# Altium schematic sheet ADAS_ECU_revB.SchDoc
size E; SheetNumber: 1; SheetTotal: 19
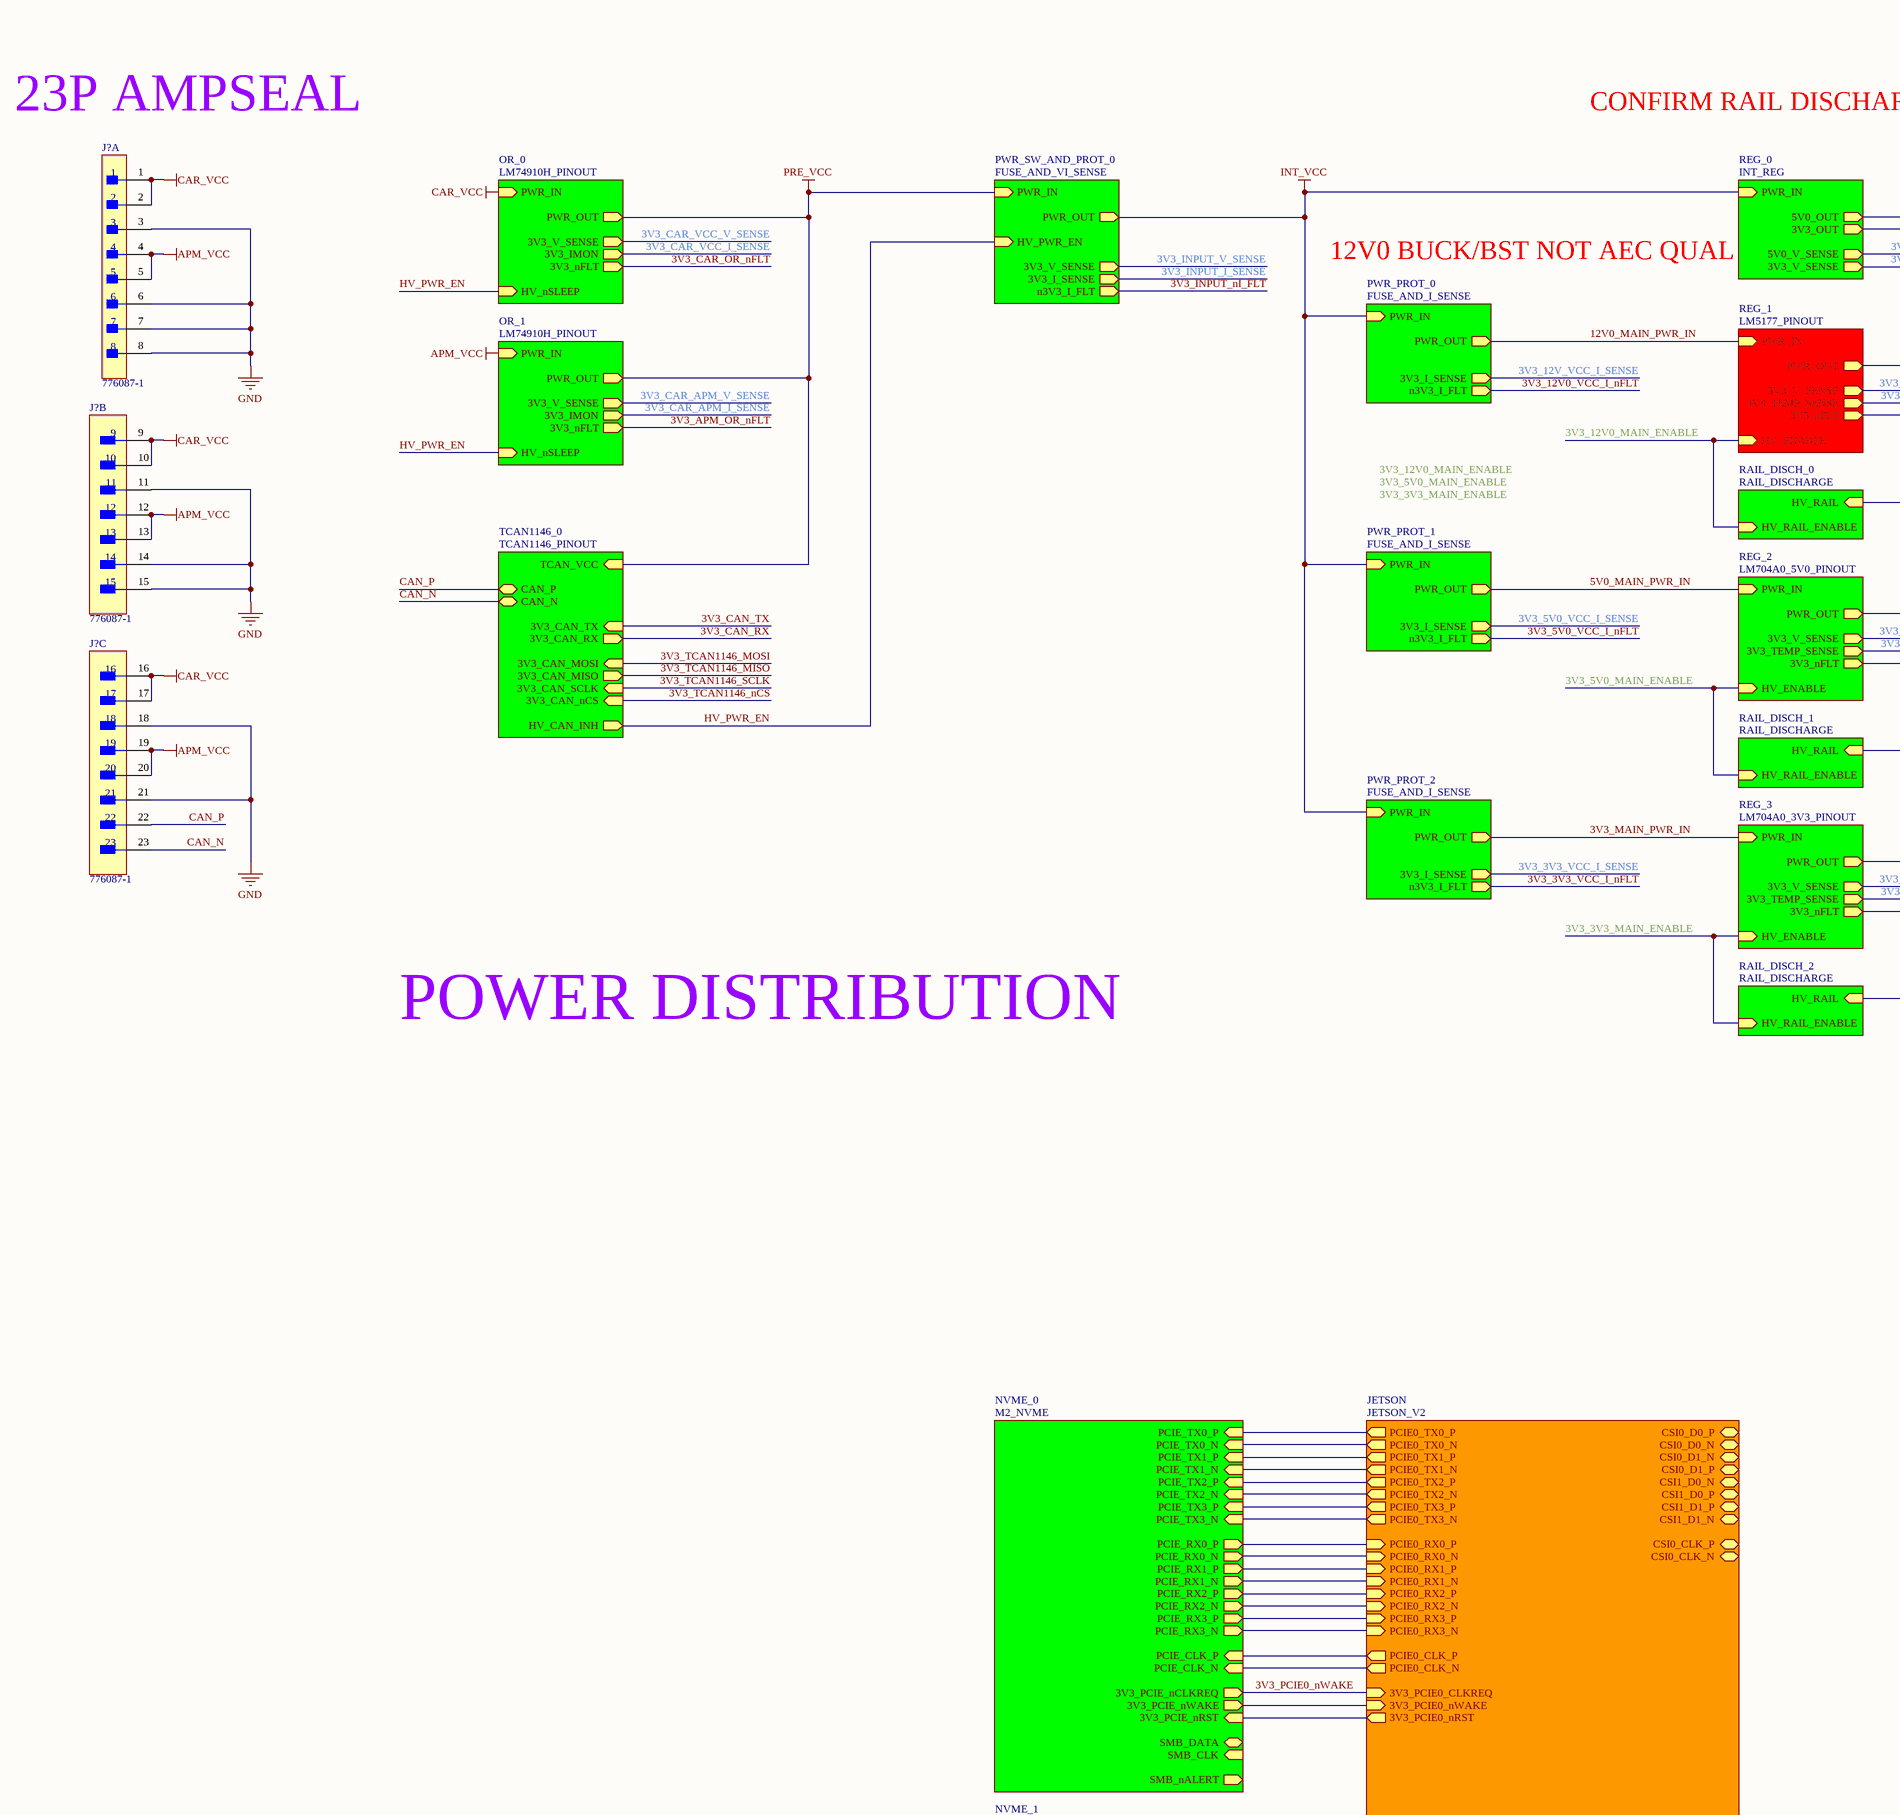
[diagram p0: ADAS_ECU_revB.SchDoc, top left]
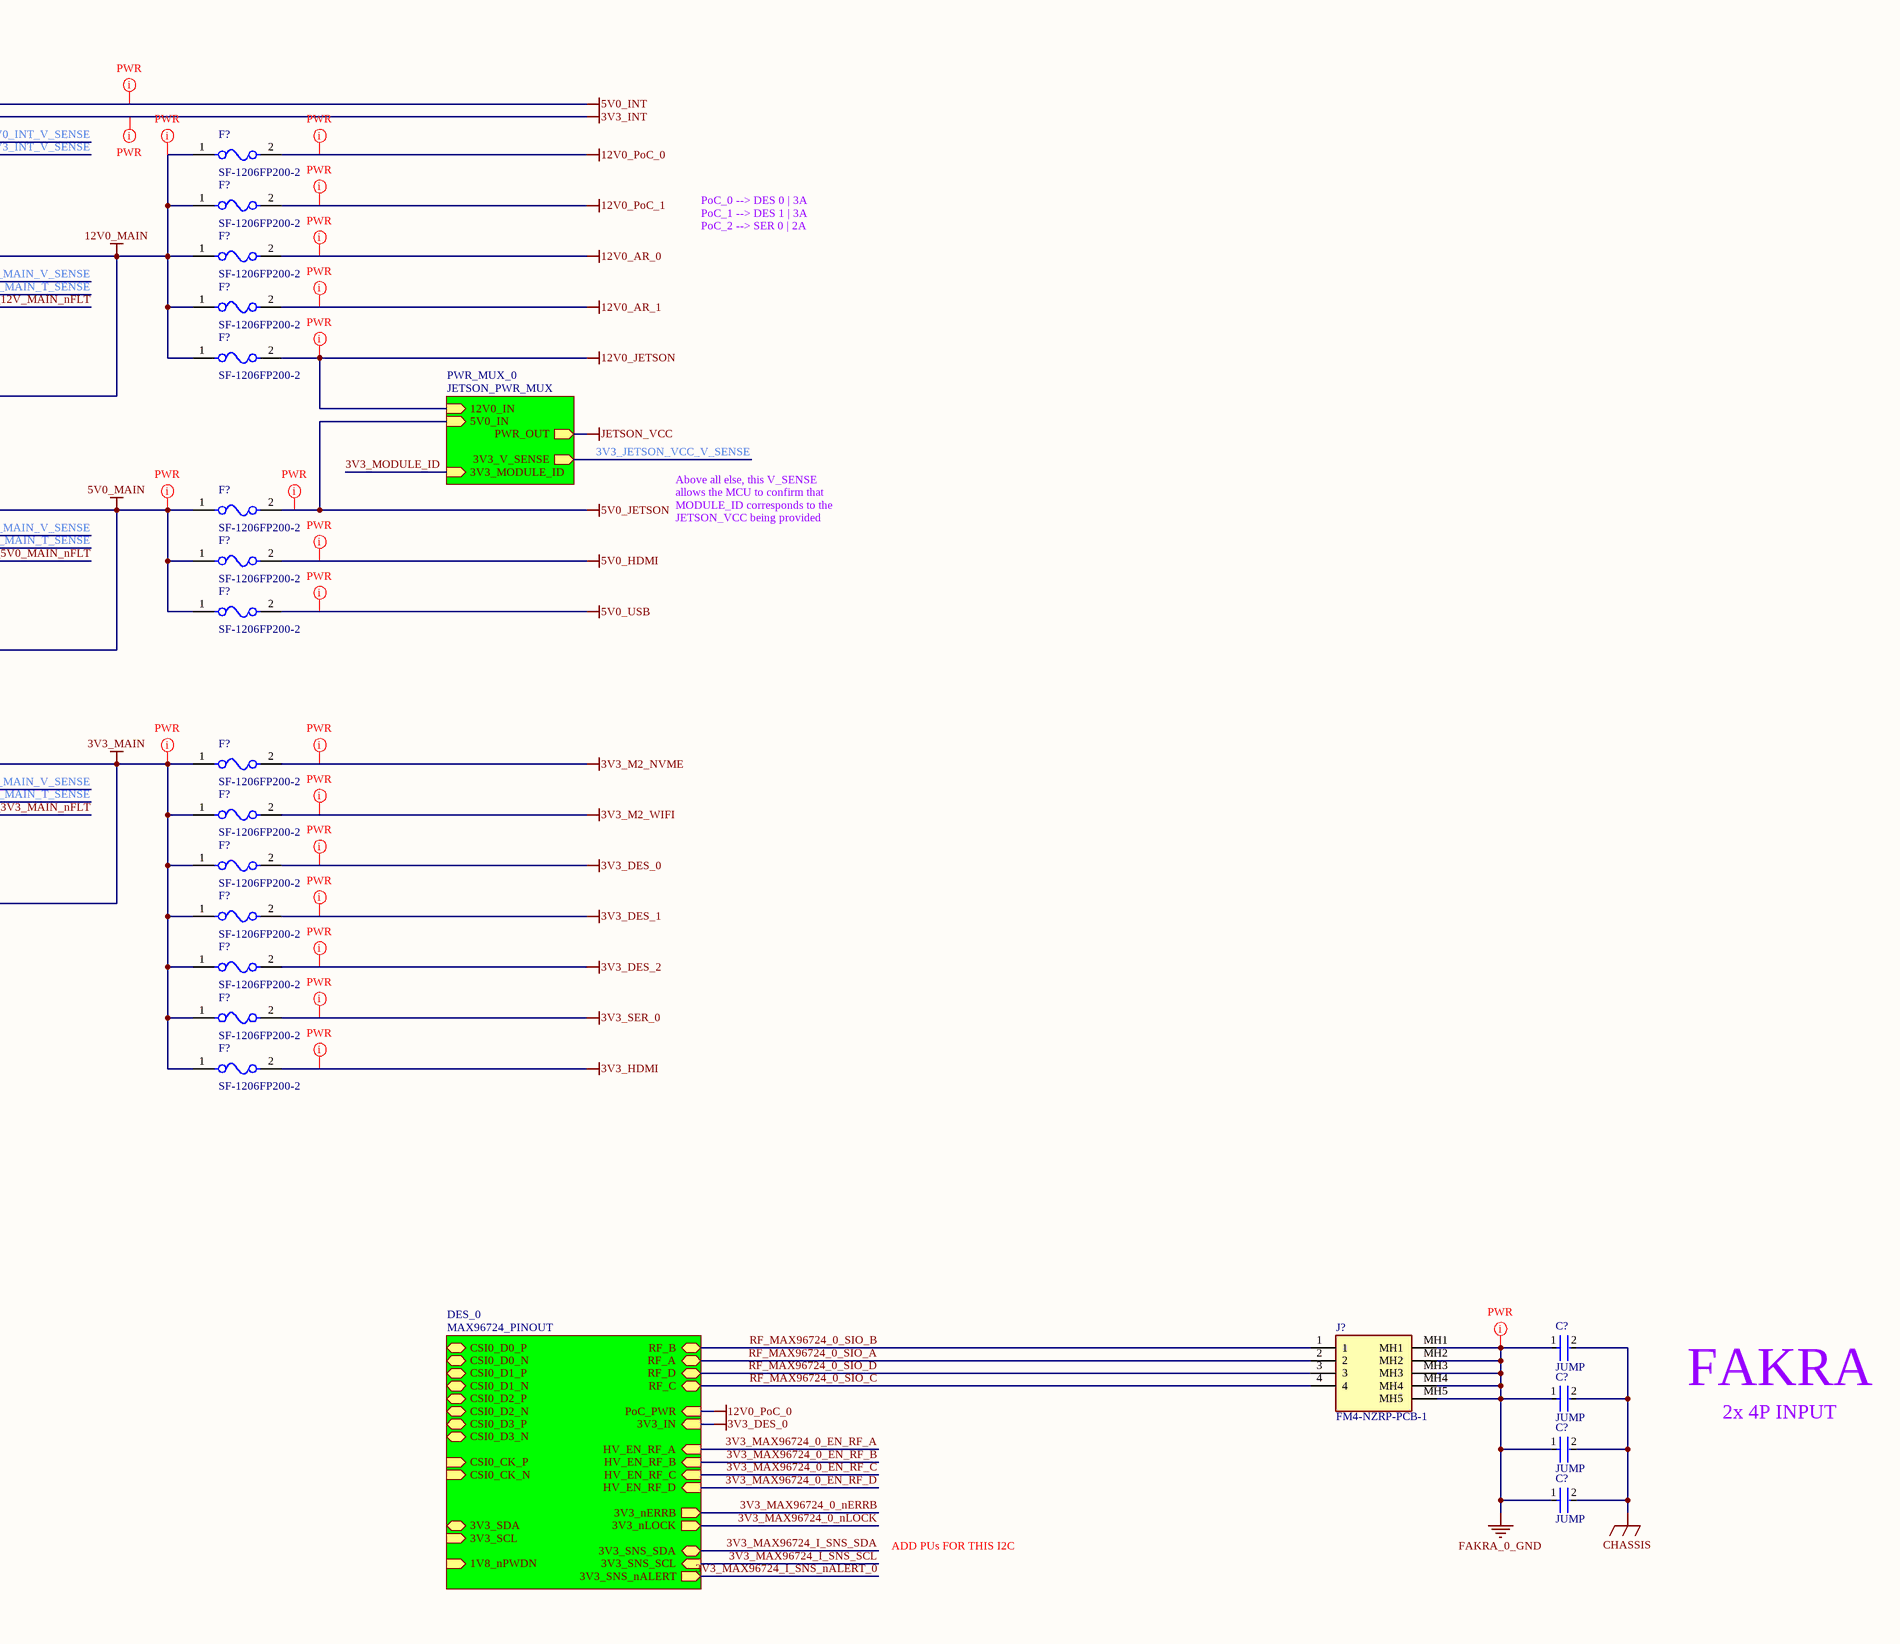
[diagram p1: ADAS_ECU_revB.SchDoc, top right]
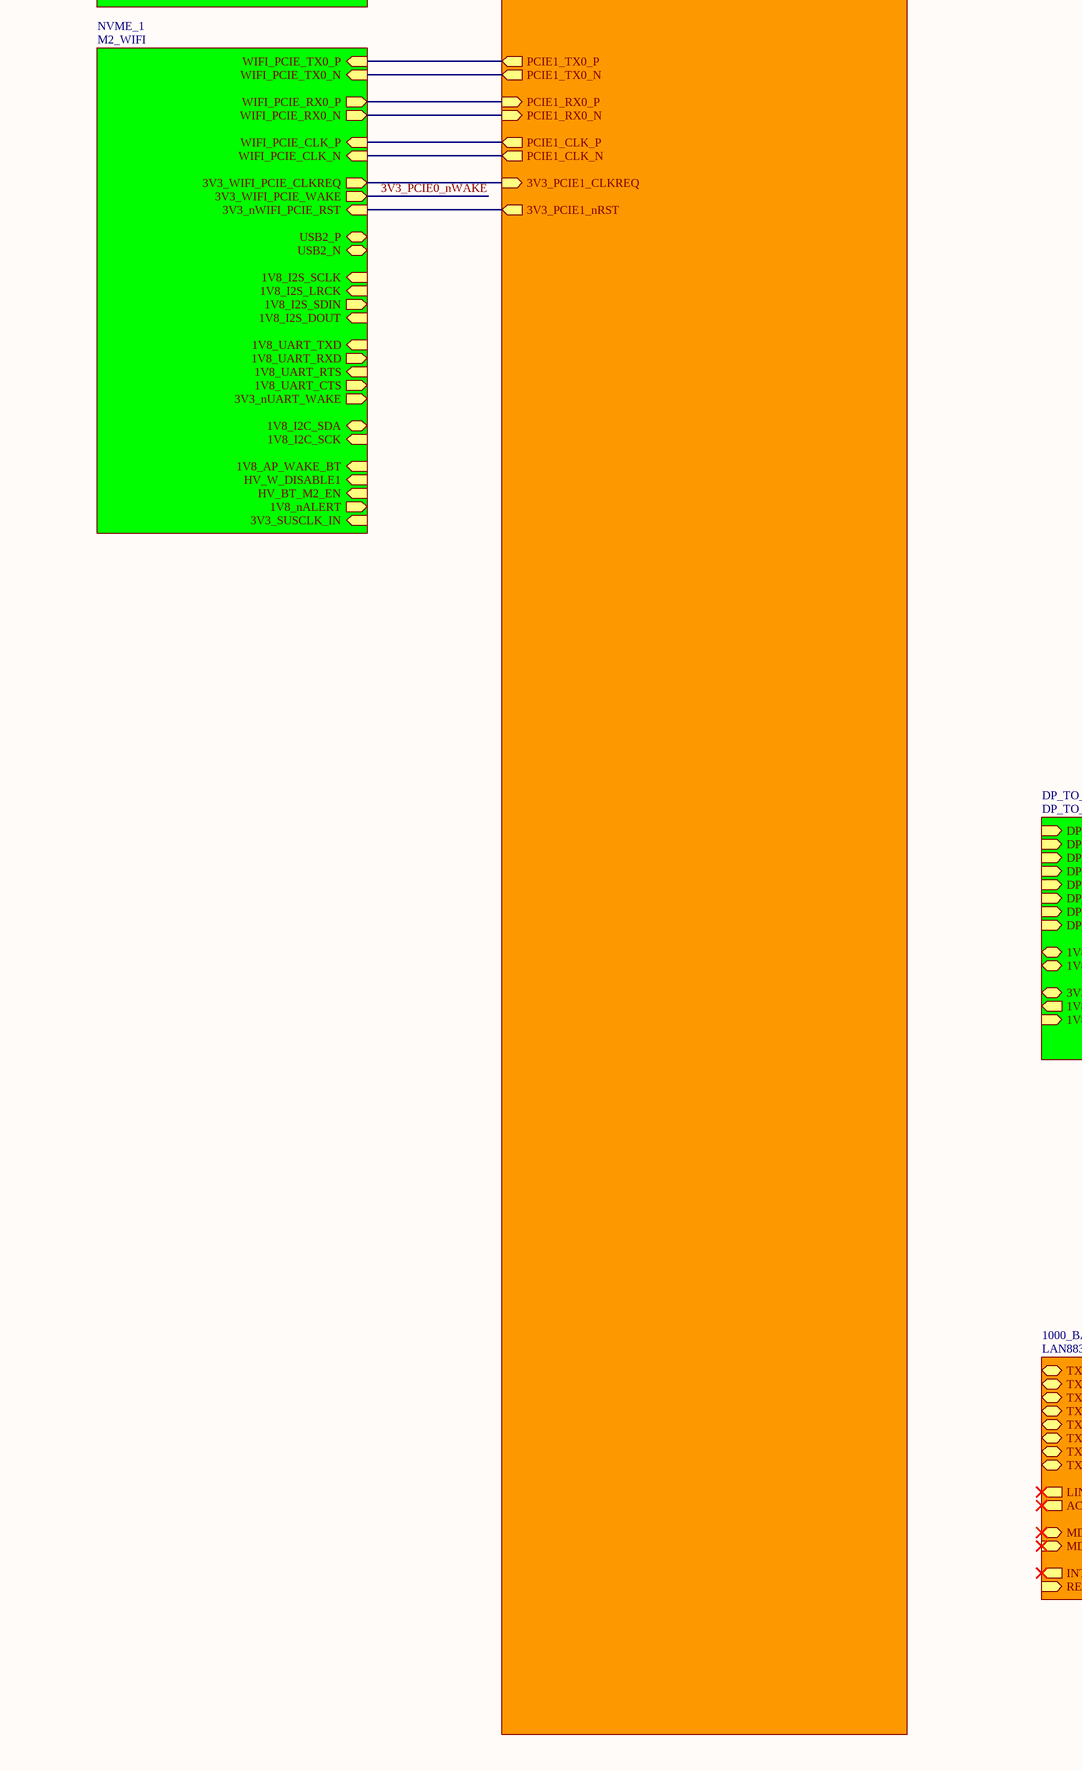
[diagram p2: ADAS_ECU_revB.SchDoc, bottom left]
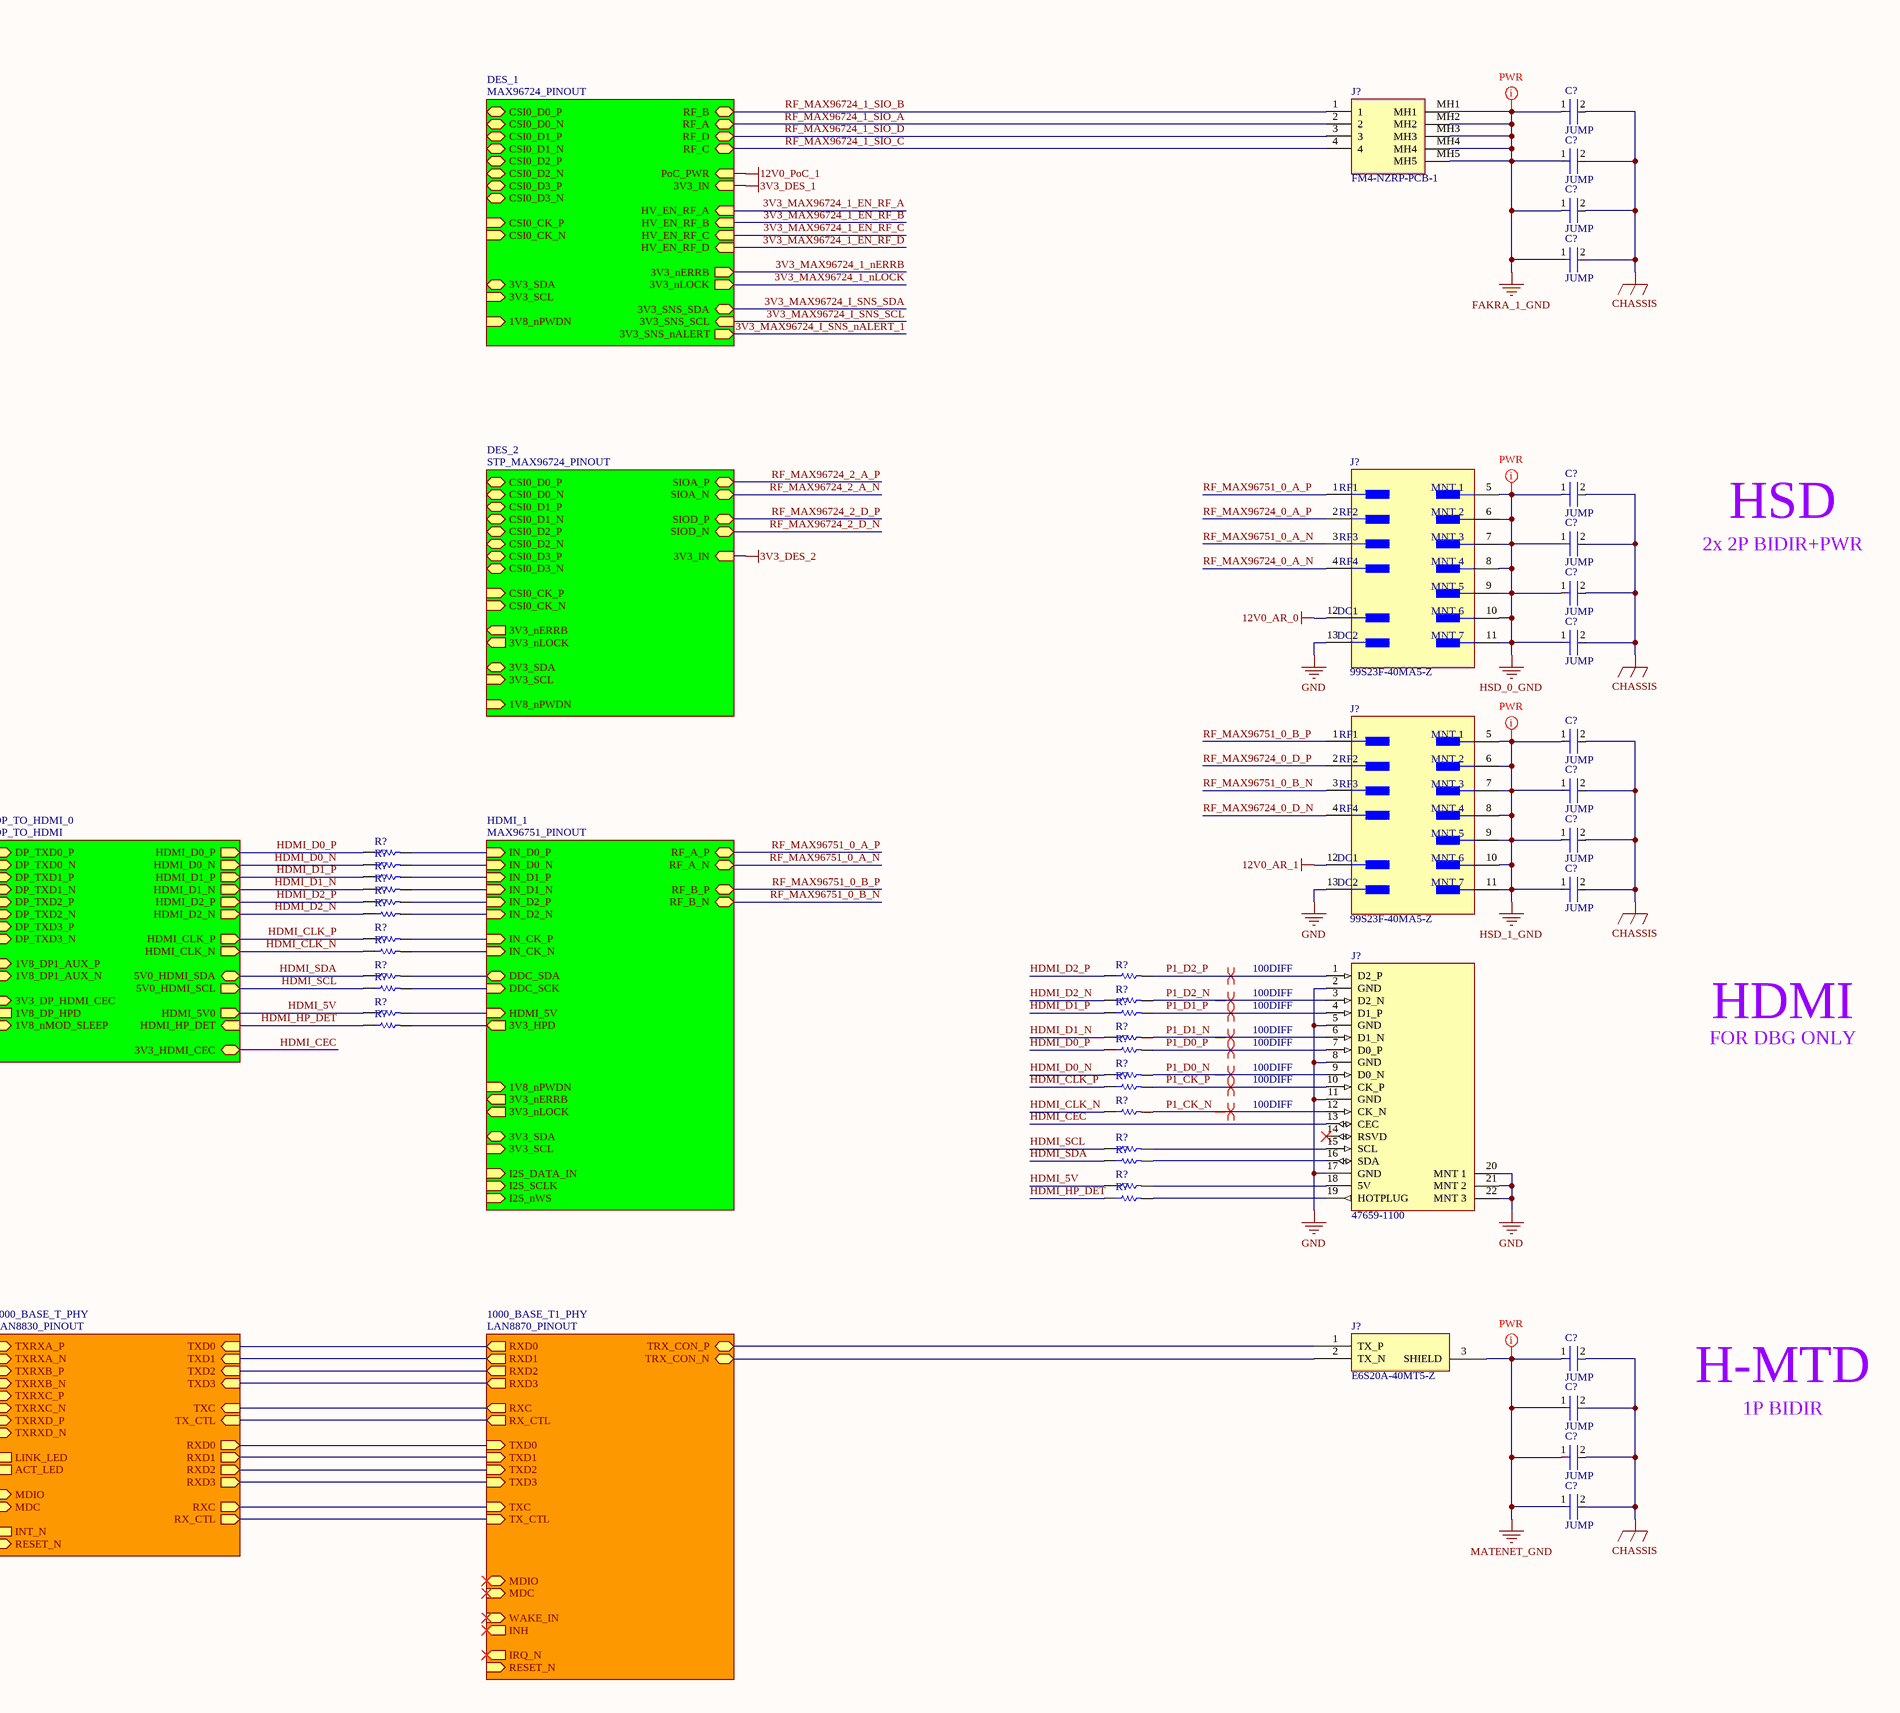
[diagram p3: ADAS_ECU_revB.SchDoc, bottom right]

## Parts
(Parts that share a designator on the sheet are numbered #1, #2 ... from top to bottom, then left to right.)
C?#1  JUMP  [FP-0402-L_1_0_0_05-W_0_5-IPC_A]
C?#2  JUMP  [FP-0402-L_1_0_0_05-W_0_5-IPC_A]
C?#3  JUMP  [FP-0402-L_1_0_0_05-W_0_5-IPC_A]
C?#4  JUMP  [FP-0402-L_1_0_0_05-W_0_5-IPC_A]
C?#5  JUMP  [FP-0402-L_1_0_0_05-W_0_5-IPC_A]
C?#6  JUMP  [FP-0402-L_1_0_0_05-W_0_5-IPC_A]
C?#7  JUMP  [FP-0402-L_1_0_0_05-W_0_5-IPC_A]
C?#8  JUMP  [FP-0402-L_1_0_0_05-W_0_5-IPC_A]
C?#9  JUMP  [FP-0402-L_1_0_0_05-W_0_5-IPC_A]
C?#10  JUMP  [FP-0402-L_1_0_0_05-W_0_5-IPC_A]
C?#11  JUMP  [FP-0402-L_1_0_0_05-W_0_5-IPC_A]
C?#12  JUMP  [FP-0402-L_1_0_0_05-W_0_5-IPC_A]
C?#13  JUMP  [FP-0402-L_1_0_0_05-W_0_5-IPC_A]
C?#14  JUMP  [FP-0402-L_1_0_0_05-W_0_5-IPC_A]
C?#15  JUMP  [FP-0402-L_1_0_0_05-W_0_5-IPC_A]
C?#16  JUMP  [FP-0402-L_1_0_0_05-W_0_5-IPC_A]
C?#17  JUMP  [FP-0402-L_1_0_0_05-W_0_5-IPC_A]
C?#18  JUMP  [FP-0402-L_1_0_0_05-W_0_5-IPC_A]
C?#19  JUMP  [FP-0402-L_1_0_0_05-W_0_5-IPC_A]
C?#20  JUMP  [FP-0402-L_1_0_0_05-W_0_5-IPC_A]
F?#1  SF-1206FP200-2  [FP-SF-1206FP-MFG]
F?#2  SF-1206FP200-2  [FP-SF-1206FP-MFG]
F?#3  SF-1206FP200-2  [FP-SF-1206FP-MFG]
F?#4  SF-1206FP200-2  [FP-SF-1206FP-MFG]
F?#5  SF-1206FP200-2  [FP-SF-1206FP-MFG]
F?#6  SF-1206FP200-2  [FP-SF-1206FP-MFG]
F?#7  SF-1206FP200-2  [FP-SF-1206FP-MFG]
F?#8  SF-1206FP200-2  [FP-SF-1206FP-MFG]
F?#9  SF-1206FP200-2  [FP-SF-1206FP-MFG]
F?#10  SF-1206FP200-2  [FP-SF-1206FP-MFG]
F?#11  SF-1206FP200-2  [FP-SF-1206FP-MFG]
F?#12  SF-1206FP200-2  [FP-SF-1206FP-MFG]
F?#13  SF-1206FP200-2  [FP-SF-1206FP-MFG]
F?#14  SF-1206FP200-2  [FP-SF-1206FP-MFG]
F?#15  SF-1206FP200-2  [FP-SF-1206FP-MFG]
J?#1  776087-1  [FP-776087-1-MFG]  (part A of 3)
J?#2  776087-1  [FP-776087-1-MFG]  (part B of 3)
J?#3  776087-1  [FP-776087-1-MFG]  (part C of 3)
J?#4  FM4-NZRP-PCB-1  [FM4-NZRP-PCB-1-Footprint-1]
J?#5  FM4-NZRP-PCB-1  [FM4-NZRP-PCB-1-Footprint-1]
J?#6  99S23F-40MA5-Z  [FP-99S23F-40MA5-Z-MFG]
J?#7  99S23F-40MA5-Z  [FP-99S23F-40MA5-Z-MFG]
J?#8  47659-1100  [FP-47659-1100-MFG]
J?#9  E6S20A-40MT5-Z  [E6S20A-40MT5-Z-Footprint-1]
R?#1  0402 JUMPER  [RESC1005X40X25ML05T05]  (value not drawn)
R?#2  0402 JUMPER  [RESC1005X40X25ML05T05]  (value not drawn)
R?#3  0402 JUMPER  [RESC1005X40X25ML05T05]  (value not drawn)
R?#4  0402 JUMPER  [RESC1005X40X25ML05T05]  (value not drawn)
R?#5  0402 JUMPER  [RESC1005X40X25ML05T05]  (value not drawn)
R?#6  0402 JUMPER  [RESC1005X40X25ML05T05]  (value not drawn)
R?#7  0402 JUMPER  [RESC1005X40X25ML05T05]  (value not drawn)
R?#8  0402 JUMPER  [RESC1005X40X25ML05T05]  (value not drawn)
R?#9  0402 JUMPER  [RESC1005X40X25ML05T05]  (value not drawn)
R?#10  0402 JUMPER  [RESC1005X40X25ML05T05]  (value not drawn)
R?#11  0402 JUMPER  [RESC1005X40X25ML05T05]  (value not drawn)
R?#12  0402 JUMPER  [RESC1005X40X25ML05T05]  (value not drawn)
R?#13  0402 JUMPER  [RESC1005X40X25ML05T05]  (value not drawn)
R?#14  0402 JUMPER  [RESC1005X40X25ML05T05]  (value not drawn)
R?#15  0402 JUMPER  [RESC1005X40X25ML05T05]  (value not drawn)
R?#16  0402 JUMPER  [RESC1005X40X25ML05T05]  (value not drawn)
R?#17  0402 JUMPER  [RESC1005X40X25ML05T05]  (value not drawn)
R?#18  0402 JUMPER  [RESC1005X40X25ML05T05]  (value not drawn)
R?#19  0402 JUMPER  [RESC1005X40X25ML05T05]  (value not drawn)
R?#20  0402 JUMPER  [RESC1005X40X25ML05T05]  (value not drawn)
R?#21  0402 JUMPER  [RESC1005X40X25ML05T05]  (value not drawn)
R?#22  0402 JUMPER  [RESC1005X40X25ML05T05]  (value not drawn)
R?#23  0402 JUMPER  [RESC1005X40X25ML05T05]  (value not drawn)
R?#24  0402 JUMPER  [RESC1005X40X25ML05T05]  (value not drawn)

## Sub-sheets
1000_BASE_T1_PHY = LAN8870_PINOUT: RXD0 (out), RXD1 (out), RXD2 (out), RXD3 (out), RXC (out), RX_CTL (out), TXD0 (in), TXD1 (in), TXD2 (in), TXD3 (in), TXC (in), TX_CTL (in), TRX_CON_P (bidir), TRX_CON_N (bidir), MDIO (bidir), MDC (in), IRQ_N (out), RESET_N (in), WAKE_IN (in), INH (out)
1000_BASE_T_PHY = LAN8830_PINOUT: TXD0 (in), TXD1 (in), TXD2 (in), TXD3 (in), TXC (in), TX_CTL (in), RXD0 (out), RXD1 (out), RXD2 (out), RXD3 (out), RXC (out), RX_CTL (out), TXRXA_P (bidir), TXRXA_N (bidir), ACT_LED (out), LINK_LED (out), MDIO (bidir), MDC (in), INT_N (out), RESET_N (in), TXRXB_P (bidir), TXRXB_N (bidir), TXRXC_P (bidir), TXRXC_N (bidir), TXRXD_P (bidir), TXRXD_N (bidir)
DES_0 = MAX96724_PINOUT: CSI0_D0_P (bidir), CSI0_D0_N (bidir), CSI0_D1_P (bidir), CSI0_D1_N (bidir), CSI0_D2_P (bidir), CSI0_D2_N (bidir), CSI0_D3_P (bidir), CSI0_D3_N (bidir), CSI0_CK_P (in), CSI0_CK_N (in), PoC_PWR (in), RF_B (bidir), RF_A (bidir), RF_C (bidir), RF_D (bidir), 3V3_IN (in), 3V3_SDA (bidir), 3V3_SCL (in), 1V8_nPWDN (in), 3V3_SNS_SDA (bidir), 3V3_SNS_SCL (in), 3V3_nERRB (out), 3V3_nLOCK (out), 3V3_SNS_nALERT (out), HV_EN_RF_A (in), HV_EN_RF_B (in), HV_EN_RF_C (in), HV_EN_RF_D (in)
DES_1 = MAX96724_PINOUT: CSI0_D0_P (bidir), CSI0_D0_N (bidir), CSI0_D1_P (bidir), CSI0_D1_N (bidir), CSI0_D2_P (bidir), CSI0_D2_N (bidir), CSI0_D3_P (bidir), CSI0_D3_N (bidir), CSI0_CK_P (in), CSI0_CK_N (in), PoC_PWR (in), RF_B (bidir), RF_A (bidir), RF_C (bidir), RF_D (bidir), 3V3_IN (in), 3V3_SDA (bidir), 3V3_SCL (in), 1V8_nPWDN (in), 3V3_SNS_SDA (bidir), 3V3_SNS_SCL (in), 3V3_nERRB (out), 3V3_nLOCK (out), HV_EN_RF_A (in), HV_EN_RF_B (in), HV_EN_RF_C (in), HV_EN_RF_D (in), 3V3_SNS_nALERT (out)
DES_2 = STP_MAX96724_PINOUT: CSI0_D0_P (bidir), CSI0_D0_N (bidir), CSI0_D1_P (bidir), CSI0_D1_N (bidir), CSI0_D2_P (bidir), CSI0_D2_N (bidir), CSI0_D3_P (bidir), CSI0_D3_N (bidir), CSI0_CK_P (in), CSI0_CK_N (in), 3V3_IN (in), 3V3_SDA (bidir), 3V3_SCL (in), 1V8_nPWDN (in), 3V3_nERRB (out), 3V3_nLOCK (out), SIOA_P (bidir), SIOA_N (bidir), SIOD_P (bidir), SIOD_N (bidir)
DP_TO_HDMI_0 = DP_TO_HDMI: 1V8_DP_HPD (out), HDMI_D2_P (out), HDMI_D2_N (out), HDMI_D1_P (out), HDMI_D1_N (out), HDMI_D0_P (out), HDMI_D0_N (out), HDMI_CLK_P (out), HDMI_CLK_N (out), HDMI_HP_DET (in), DP_TXD0_P (in), DP_TXD0_N (in), DP_TXD1_P (in), DP_TXD1_N (in), DP_TXD2_P (in), DP_TXD2_N (in), DP_TXD3_P (in), DP_TXD3_N (in), 1V8_DP1_AUX_N (bidir), 1V8_DP1_AUX_P (bidir), 3V3_HDMI_CEC (bidir), 1V8_nMOD_SLEEP (in), 3V3_DP_HDMI_CEC (bidir), 5V0_HDMI_SDA (bidir), 5V0_HDMI_SCL (out), HDMI_5V0 (out)
HDMI_1 = MAX96751_PINOUT: IN_D0_P (in), IN_D0_N (in), IN_D1_P (in), IN_D1_N (in), IN_D2_P (in), IN_D2_N (in), IN_CK_N (in), IN_CK_P (in), DDC_SCK (in), DDC_SDA (bidir), 3V3_HPD (out), RF_A_P (bidir), RF_A_N (bidir), RF_B_P (bidir), RF_B_N (bidir), HDMI_5V (in), 3V3_SDA (bidir), 3V3_SCL (in), I2S_DATA_IN (in), I2S_SCLK (in), I2S_nWS (in), 3V3_nERRB (out), 3V3_nLOCK (out), 1V8_nPWDN (in)
JETSON = JETSON_V2: PCIE0_TX0_N (out), PCIE0_TX0_P (out), PCIE0_TX1_N (out), PCIE0_TX1_P (out), PCIE0_TX2_N (out), PCIE0_TX2_P (out), PCIE0_TX3_N (out), PCIE0_TX3_P (out), PCIE0_RX0_N (in), PCIE0_RX0_P (in), PCIE0_RX1_N (in), PCIE0_RX1_P (in), PCIE0_RX2_N (in), PCIE0_RX2_P (in), PCIE0_RX3_N (in), PCIE0_RX3_P (in), PCIE0_CLK_N (out), PCIE0_CLK_P (out), 3V3_PCIE0_CLKREQ (in), 3V3_PCIE0_nWAKE (in), 3V3_PCIE0_nRST (out), PCIE1_TX0_N (out), PCIE1_TX0_P (out), PCIE1_RX0_N (in), PCIE1_RX0_P (in), PCIE1_CLK_N (out), PCIE1_CLK_P (out), 3V3_PCIE1_nRST (out), 3V3_PCIE1_CLKREQ (in), CSI0_D0_N (bidir), CSI0_D0_P (bidir), CSI0_D1_N (bidir), CSI0_D1_P (bidir), CSI1_D0_N (bidir), CSI1_D0_P (bidir), CSI1_D1_N (bidir), CSI1_D1_P (bidir), CSI0_CLK_N (bidir), CSI0_CLK_P (bidir)
NVME_0 = M2_NVME: SMB_DATA (bidir), SMB_CLK (in), SMB_nALERT (out), PCIE_TX3_N (in), PCIE_TX3_P (in), PCIE_TX2_N (in), PCIE_TX2_P (in), PCIE_TX1_N (in), PCIE_TX1_P (in), PCIE_TX0_N (in), PCIE_TX0_P (in), PCIE_RX3_N (out), PCIE_RX3_P (out), PCIE_RX2_N (out), PCIE_RX2_P (out), PCIE_RX1_N (out), PCIE_RX1_P (out), PCIE_RX0_N (out), PCIE_RX0_P (out), PCIE_CLK_N (in), PCIE_CLK_P (in), 3V3_PCIE_nRST (in), 3V3_PCIE_nCLKREQ (out), 3V3_PCIE_nWAKE (out)
NVME_1 = M2_WIFI: WIFI_PCIE_TX0_P (in), WIFI_PCIE_TX0_N (in), WIFI_PCIE_RX0_P (out), WIFI_PCIE_RX0_N (out), WIFI_PCIE_CLK_P (in), WIFI_PCIE_CLK_N (in), USB2_P (bidir), USB2_N (bidir), 1V8_I2S_SCLK (in), 1V8_I2S_LRCK (in), 1V8_I2S_SDIN (out), 1V8_I2S_DOUT (in), 1V8_UART_RXD (out), 1V8_UART_TXD (in), 1V8_UART_RTS (in), 1V8_UART_CTS (out), 3V3_nUART_WAKE (out), 3V3_WIFI_PCIE_CLKREQ (out), 3V3_WIFI_PCIE_WAKE (out), 3V3_nWIFI_PCIE_RST (in), 1V8_I2C_SCK (in), 1V8_I2C_SDA (bidir), HV_W_DISABLE1 (in), HV_BT_M2_EN (in), 1V8_nALERT (out), 3V3_SUSCLK_IN (in), 1V8_AP_WAKE_BT (in)
OR_0 = LM74910H_PINOUT: PWR_IN (in), PWR_OUT (out), 3V3_nFLT (out), HV_nSLEEP (in), 3V3_IMON (out), 3V3_V_SENSE (out)
OR_1 = LM74910H_PINOUT: PWR_IN (in), PWR_OUT (out), 3V3_nFLT (out), HV_nSLEEP (in), 3V3_IMON (out), 3V3_V_SENSE (out)
PWR_MUX_0 = JETSON_PWR_MUX: 12V0_IN (in), 5V0_IN (in), 3V3_MODULE_ID (in), PWR_OUT (out), 3V3_V_SENSE (out)
PWR_PROT_0 = FUSE_AND_I_SENSE: PWR_IN (in), PWR_OUT (out), 3V3_I_SENSE (out), n3V3_I_FLT (out)
PWR_PROT_1 = FUSE_AND_I_SENSE: PWR_IN (in), PWR_OUT (out), 3V3_I_SENSE (out), n3V3_I_FLT (out)
PWR_PROT_2 = FUSE_AND_I_SENSE: PWR_IN (in), PWR_OUT (out), 3V3_I_SENSE (out), n3V3_I_FLT (out)
PWR_SW_AND_PROT_0 = FUSE_AND_VI_SENSE: PWR_IN (in), PWR_OUT (out), 3V3_I_SENSE (out), n3V3_I_FLT (out), HV_PWR_EN (in), 3V3_V_SENSE (out)
RAIL_DISCH_0 = RAIL_DISCHARGE: HV_RAIL (in), HV_RAIL_ENABLE (in)
RAIL_DISCH_1 = RAIL_DISCHARGE: HV_RAIL_ENABLE (in), HV_RAIL (in)
RAIL_DISCH_2 = RAIL_DISCHARGE: HV_RAIL_ENABLE (in), HV_RAIL (in)
REG_0 = INT_REG: PWR_IN (in), 5V0_OUT (out), 3V3_OUT (out), 5V0_V_SENSE (out), 3V3_V_SENSE (out)
REG_1 = LM5177_PINOUT: PWR_IN (in), PWR_OUT (out), HV_ENABLE (in), 3V3_nFLT (out), 3V3_V_SENSE (out), 3V3_TEMP_SENSE (out)
REG_2 = LM704A0_5V0_PINOUT: PWR_IN (in), PWR_OUT (out), HV_ENABLE (in), 3V3_nFLT (out), 3V3_V_SENSE (out), 3V3_TEMP_SENSE (out)
REG_3 = LM704A0_3V3_PINOUT: PWR_IN (in), PWR_OUT (out), HV_ENABLE (in), 3V3_nFLT (out), 3V3_V_SENSE (out), 3V3_TEMP_SENSE (out)
TCAN1146_0 = TCAN1146_PINOUT: CAN_P (bidir), CAN_N (bidir), HV_CAN_INH (out), TCAN_VCC (in), 3V3_CAN_TX (in), 3V3_CAN_RX (out), 3V3_CAN_MOSI (in), 3V3_CAN_MISO (out), 3V3_CAN_SCLK (in), 3V3_CAN_nCS (in)

## Nets
3V3_DES_0: F?#11.2 ; sheet DES_0/3V3_IN
3V3_DES_1: F?#12.2 ; sheet DES_1/3V3_IN
3V3_DES_2: F?#13.2 ; sheet DES_2/3V3_IN
3V3_HDMI: F?#15.2
3V3_INT: sheet REG_0/3V3_OUT
3V3_M2_NVME: F?#9.2
3V3_M2_WIFI: F?#10.2
3V3_MAIN: F?#9.1 F?#10.1 F?#11.1 F?#12.1 F?#13.1 F?#14.1 F?#15.1 ; sheet RAIL_DISCH_2/HV_RAIL, sheet REG_3/PWR_OUT
3V3_SER_0: F?#14.2
5V0_HDMI: F?#7.2
5V0_INT: sheet REG_0/5V0_OUT
5V0_JETSON: F?#6.2 ; sheet PWR_MUX_0/5V0_IN
5V0_MAIN: F?#6.1 F?#7.1 F?#8.1 ; sheet RAIL_DISCH_1/HV_RAIL, sheet REG_2/PWR_OUT
5V0_USB: F?#8.2
12V0_AR_0: F?#3.2 J?#6.12
12V0_AR_1: F?#4.2 J?#7.12
12V0_JETSON: F?#5.2 ; sheet PWR_MUX_0/12V0_IN
12V0_MAIN: F?#1.1 F?#2.1 F?#3.1 F?#4.1 F?#5.1 ; sheet RAIL_DISCH_0/HV_RAIL, sheet REG_1/PWR_OUT
12V0_PoC_0: F?#1.2 ; sheet DES_0/PoC_PWR
12V0_PoC_1: F?#2.2 ; sheet DES_1/PoC_PWR
APM_VCC: J?#1.4 J?#1.5 J?#2.12 J?#2.13 J?#3.19 J?#3.20 ; sheet OR_1/PWR_IN
CAR_VCC: J?#1.1 J?#1.2 J?#2.9 J?#2.10 J?#3.16 J?#3.17 ; sheet OR_0/PWR_IN
CHASSIS: C?#1.2 C?#2.2 C?#3.2 C?#4.2 C?#5.2 C?#6.2 C?#7.2 C?#8.2 C?#9.2 C?#10.2 C?#11.2 C?#12.2 C?#13.2 C?#14.2 C?#15.2 C?#16.2 C?#17.2 C?#18.2 C?#19.2 C?#20.2
FAKRA_0_GND: C?#1.1 C?#2.1 C?#3.1 C?#4.1 J?#4.MH1 J?#4.MH2 J?#4.MH3 J?#4.MH4 J?#4.MH5
FAKRA_1_GND: C?#5.1 C?#6.1 C?#7.1 C?#8.1 J?#5.MH1 J?#5.MH2 J?#5.MH3 J?#5.MH4 J?#5.MH5
GND: J?#1.3 J?#1.6 J?#1.7 J?#1.8 J?#2.11 J?#2.14 J?#2.15 J?#3.18 J?#3.21 J?#6.13 J?#7.13 J?#8.2(GND) J?#8.5(GND) J?#8.8(GND) J?#8.11(GND) J?#8.17(GND) J?#8.20(MNT_1) J?#8.21(MNT_2) J?#8.22(MNT_3)
HSD_0_GND: C?#9.1 C?#10.1 C?#11.1 C?#12.1 J?#6.5(MNT_1) J?#6.6(MNT_2) J?#6.7(MNT_3) J?#6.8(MNT_4) J?#6.9(MNT_5) J?#6.10(MNT_6) J?#6.11(MNT_7)
HSD_1_GND: C?#13.1 C?#14.1 C?#15.1 C?#16.1 J?#7.5(MNT_1) J?#7.6(MNT_2) J?#7.7(MNT_3) J?#7.8(MNT_4) J?#7.9(MNT_5) J?#7.10(MNT_6) J?#7.11(MNT_7)
INT_VCC: sheet PWR_PROT_0/PWR_IN, sheet REG_0/PWR_IN, sheet PWR_PROT_1/PWR_IN, sheet PWR_PROT_2/PWR_IN, sheet PWR_SW_AND_PROT_0/PWR_OUT
JETSON_VCC: sheet PWR_MUX_0/PWR_OUT
MATENET_GND: C?#17.1 C?#18.1 C?#19.1 C?#20.1 J?#9.3(SHIELD)
PRE_VCC: sheet TCAN1146_0/TCAN_VCC, sheet OR_0/PWR_OUT, sheet OR_1/PWR_OUT, sheet PWR_SW_AND_PROT_0/PWR_IN
3V3_3V3_INT_V_SENSE: sheet REG_0/3V3_V_SENSE
3V3_3V3_MAIN_ENABLE: sheet RAIL_DISCH_2/HV_RAIL_ENABLE, sheet REG_3/HV_ENABLE
3V3_3V3_MAIN_nFLT: sheet REG_3/3V3_nFLT
3V3_3V3_MAIN_T_SENSE: sheet REG_3/3V3_TEMP_SENSE
3V3_3V3_MAIN_V_SENSE: sheet REG_3/3V3_V_SENSE
3V3_3V3_VCC_I_nFLT: sheet PWR_PROT_2/n3V3_I_FLT
3V3_3V3_VCC_I_SENSE: sheet PWR_PROT_2/3V3_I_SENSE
3V3_5V0_INT_V_SENSE: sheet REG_0/5V0_V_SENSE
3V3_5V0_MAIN_ENABLE: sheet RAIL_DISCH_1/HV_RAIL_ENABLE, sheet REG_2/HV_ENABLE
3V3_5V0_MAIN_nFLT: sheet REG_2/3V3_nFLT
3V3_5V0_MAIN_T_SENSE: sheet REG_2/3V3_TEMP_SENSE
3V3_5V0_MAIN_V_SENSE: sheet REG_2/3V3_V_SENSE
3V3_5V0_VCC_I_nFLT: sheet PWR_PROT_1/n3V3_I_FLT
3V3_5V0_VCC_I_SENSE: sheet PWR_PROT_1/3V3_I_SENSE
3V3_12V0_MAIN_ENABLE: sheet RAIL_DISCH_0/HV_RAIL_ENABLE, sheet REG_1/HV_ENABLE
3V3_12V0_VCC_I_nFLT: sheet PWR_PROT_0/n3V3_I_FLT
3V3_12V_MAIN_nFLT: sheet REG_1/3V3_nFLT
3V3_12V_MAIN_T_SENSE: sheet REG_1/3V3_TEMP_SENSE
3V3_12V_MAIN_V_SENSE: sheet REG_1/3V3_V_SENSE
3V3_12V_VCC_I_SENSE: sheet PWR_PROT_0/3V3_I_SENSE
3V3_APM_OR_nFLT: sheet OR_1/3V3_nFLT
3V3_CAN_RX: sheet TCAN1146_0/3V3_CAN_RX
3V3_CAN_TX: sheet TCAN1146_0/3V3_CAN_TX
3V3_CAR_APM_I_SENSE: sheet OR_1/3V3_IMON
3V3_CAR_APM_V_SENSE: sheet OR_1/3V3_V_SENSE
3V3_CAR_OR_nFLT: sheet OR_0/3V3_nFLT
3V3_CAR_VCC_I_SENSE: sheet OR_0/3V3_IMON
3V3_CAR_VCC_V_SENSE: sheet OR_0/3V3_V_SENSE
3V3_INPUT_I_SENSE: sheet PWR_SW_AND_PROT_0/3V3_I_SENSE
3V3_INPUT_nI_FLT: sheet PWR_SW_AND_PROT_0/n3V3_I_FLT
3V3_INPUT_V_SENSE: sheet PWR_SW_AND_PROT_0/3V3_V_SENSE
3V3_JETSON_VCC_V_SENSE: sheet PWR_MUX_0/3V3_V_SENSE
3V3_MAIN_PWR_IN: sheet PWR_PROT_2/PWR_OUT, sheet REG_3/PWR_IN
3V3_MAX96724_0_EN_RF_A: sheet DES_0/HV_EN_RF_A
3V3_MAX96724_0_EN_RF_B: sheet DES_0/HV_EN_RF_B
3V3_MAX96724_0_EN_RF_C: sheet DES_0/HV_EN_RF_C
3V3_MAX96724_0_EN_RF_D: sheet DES_0/HV_EN_RF_D
3V3_MAX96724_0_nERRB: sheet DES_0/3V3_nERRB
3V3_MAX96724_0_nLOCK: sheet DES_0/3V3_nLOCK
3V3_MAX96724_1_EN_RF_A: sheet DES_1/HV_EN_RF_A
3V3_MAX96724_1_EN_RF_B: sheet DES_1/HV_EN_RF_B
3V3_MAX96724_1_EN_RF_C: sheet DES_1/HV_EN_RF_C
3V3_MAX96724_1_EN_RF_D: sheet DES_1/HV_EN_RF_D
3V3_MAX96724_1_nERRB: sheet DES_1/3V3_nERRB
3V3_MAX96724_1_nLOCK: sheet DES_1/3V3_nLOCK
3V3_MAX96724_I_SNS_nALERT_0: sheet DES_0/3V3_SNS_nALERT
3V3_MAX96724_I_SNS_nALERT_1: sheet DES_1/3V3_SNS_nALERT
3V3_MAX96724_I_SNS_SCL: sheet DES_0/3V3_SNS_SCL, sheet DES_1/3V3_SNS_SCL
3V3_MAX96724_I_SNS_SDA: sheet DES_0/3V3_SNS_SDA, sheet DES_1/3V3_SNS_SDA
3V3_MODULE_ID: sheet PWR_MUX_0/3V3_MODULE_ID
3V3_PCIE0_nWAKE: sheet NVME_0/3V3_PCIE_nCLKREQ, sheet NVME_1/3V3_WIFI_PCIE_WAKE, sheet JETSON/3V3_PCIE0_CLKREQ
3V3_TCAN1146_MISO: sheet TCAN1146_0/3V3_CAN_MISO
3V3_TCAN1146_MOSI: sheet TCAN1146_0/3V3_CAN_MOSI
3V3_TCAN1146_nCS: sheet TCAN1146_0/3V3_CAN_nCS
3V3_TCAN1146_SCLK: sheet TCAN1146_0/3V3_CAN_SCLK
5V0_MAIN_PWR_IN: sheet REG_2/PWR_IN, sheet PWR_PROT_1/PWR_OUT
12V0_MAIN_PWR_IN: sheet PWR_PROT_0/PWR_OUT, sheet REG_1/PWR_IN
CAN_N: J?#3.23 ; sheet TCAN1146_0/CAN_N
CAN_P: J?#3.22 ; sheet TCAN1146_0/CAN_P
HDMI_5V: R?#13.1 R?#23.1 ; sheet DP_TO_HDMI_0/HDMI_5V0
HDMI_CEC: J?#8.13(CEC) ; sheet DP_TO_HDMI_0/3V3_HDMI_CEC
HDMI_CLK_N: R?#8.1 R?#20.1 ; sheet DP_TO_HDMI_0/HDMI_CLK_N
HDMI_CLK_P: R?#7.1 R?#19.1 ; sheet DP_TO_HDMI_0/HDMI_CLK_P
HDMI_D0_N: R?#2.1 R?#18.1 ; sheet DP_TO_HDMI_0/HDMI_D0_N
HDMI_D0_P: R?#1.1 R?#17.1 ; sheet DP_TO_HDMI_0/HDMI_D0_P
HDMI_D1_N: R?#4.1 R?#16.1 ; sheet DP_TO_HDMI_0/HDMI_D1_N
HDMI_D1_P: R?#3.1 R?#14.1 ; sheet DP_TO_HDMI_0/HDMI_D1_P
HDMI_D2_N: R?#6.1 R?#12.1 ; sheet DP_TO_HDMI_0/HDMI_D2_N
HDMI_D2_P: R?#5.1 R?#10.1 ; sheet DP_TO_HDMI_0/HDMI_D2_P
HDMI_HP_DET: R?#15.1 R?#24.1 ; sheet DP_TO_HDMI_0/HDMI_HP_DET
HDMI_SCL: R?#11.1 R?#21.1 ; sheet DP_TO_HDMI_0/5V0_HDMI_SCL
HDMI_SDA: R?#9.1 R?#22.1 ; sheet DP_TO_HDMI_0/5V0_HDMI_SDA
HV_PWR_EN: sheet TCAN1146_0/HV_CAN_INH, sheet OR_0/HV_nSLEEP, sheet OR_1/HV_nSLEEP, sheet PWR_SW_AND_PROT_0/HV_PWR_EN
P1_CK_N: J?#8.12(CK_N) R?#20.2
P1_CK_P: J?#8.10(CK_P) R?#19.2
P1_D0_N: J?#8.9(D0_N) R?#18.2
P1_D0_P: J?#8.7(D0_P) R?#17.2
P1_D1_N: J?#8.6(D1_N) R?#16.2
P1_D1_P: J?#8.4(D1_P) R?#14.2
P1_D2_N: J?#8.3(D2_N) R?#12.2
P1_D2_P: J?#8.1(D2_P) R?#10.2
RF_MAX96724_0_A_N: J?#6.4
RF_MAX96724_0_A_P: J?#6.2
RF_MAX96724_0_D_N: J?#7.4
RF_MAX96724_0_D_P: J?#7.2
RF_MAX96724_0_SIO_A: J?#4.2 ; sheet DES_0/RF_A
RF_MAX96724_0_SIO_B: J?#4.1 ; sheet DES_0/RF_B
RF_MAX96724_0_SIO_C: J?#4.4 ; sheet DES_0/RF_C
RF_MAX96724_0_SIO_D: J?#4.3 ; sheet DES_0/RF_D
RF_MAX96724_1_SIO_A: J?#5.2 ; sheet DES_1/RF_A
RF_MAX96724_1_SIO_B: J?#5.1 ; sheet DES_1/RF_B
RF_MAX96724_1_SIO_C: J?#5.4 ; sheet DES_1/RF_C
RF_MAX96724_1_SIO_D: J?#5.3 ; sheet DES_1/RF_D
RF_MAX96724_2_A_N: sheet DES_2/SIOA_N
RF_MAX96724_2_A_P: sheet DES_2/SIOA_P
RF_MAX96724_2_D_N: sheet DES_2/SIOD_N
RF_MAX96724_2_D_P: sheet DES_2/SIOD_P
RF_MAX96751_0_A_N: J?#6.3 ; sheet HDMI_1/RF_A_N
RF_MAX96751_0_A_P: J?#6.1 ; sheet HDMI_1/RF_A_P
RF_MAX96751_0_B_N: J?#7.3 ; sheet HDMI_1/RF_B_N
RF_MAX96751_0_B_P: J?#7.1 ; sheet HDMI_1/RF_B_P
NetJ?#8_15: J?#8.15(SCL) R?#21.2
NetJ?#8_16: J?#8.16(SDA) R?#22.2
NetJ?#8_18: J?#8.18(5V) R?#23.2
NetJ?#8_19: J?#8.19(HOTPLUG) R?#24.2
NetJ?#9_1: J?#9.1(TX_P) ; sheet 1000_BASE_T1_PHY/TRX_CON_P
NetJ?#9_2: J?#9.2(TX_N) ; sheet 1000_BASE_T1_PHY/TRX_CON_N
NetR?#1_2: R?#1.2 ; sheet HDMI_1/IN_D0_P
NetR?#2_2: R?#2.2 ; sheet HDMI_1/IN_D0_N
NetR?#3_2: R?#3.2 ; sheet HDMI_1/IN_D1_P
NetR?#4_2: R?#4.2 ; sheet HDMI_1/IN_D1_N
NetR?#5_2: R?#5.2 ; sheet HDMI_1/IN_D2_P
NetR?#6_2: R?#6.2 ; sheet HDMI_1/IN_D2_N
NetR?#7_2: R?#7.2 ; sheet HDMI_1/IN_CK_P
NetR?#8_2: R?#8.2 ; sheet HDMI_1/IN_CK_N
NetR?#9_2: R?#9.2 ; sheet HDMI_1/DDC_SDA
NetR?#11_2: R?#11.2 ; sheet HDMI_1/DDC_SCK
NetR?#13_2: R?#13.2 ; sheet HDMI_1/HDMI_5V
NetR?#15_2: R?#15.2 ; sheet HDMI_1/3V3_HPD
(unnamed): sheet 1000_BASE_T_PHY/TXD0, sheet 1000_BASE_T1_PHY/RXD0
(unnamed): sheet 1000_BASE_T_PHY/TXD1, sheet 1000_BASE_T1_PHY/RXD1
(unnamed): sheet 1000_BASE_T_PHY/TXD2, sheet 1000_BASE_T1_PHY/RXD2
(unnamed): sheet 1000_BASE_T_PHY/TXD3, sheet 1000_BASE_T1_PHY/RXD3
(unnamed): sheet 1000_BASE_T_PHY/TXC, sheet 1000_BASE_T1_PHY/RXC
(unnamed): sheet 1000_BASE_T_PHY/TX_CTL, sheet 1000_BASE_T1_PHY/RX_CTL
(unnamed): sheet 1000_BASE_T_PHY/RXD0, sheet 1000_BASE_T1_PHY/TXD0
(unnamed): sheet 1000_BASE_T_PHY/RXD1, sheet 1000_BASE_T1_PHY/TXD1
(unnamed): sheet 1000_BASE_T_PHY/RXD2, sheet 1000_BASE_T1_PHY/TXD2
(unnamed): sheet 1000_BASE_T_PHY/RXD3, sheet 1000_BASE_T1_PHY/TXD3
(unnamed): sheet 1000_BASE_T_PHY/RXC, sheet 1000_BASE_T1_PHY/TXC
(unnamed): sheet 1000_BASE_T_PHY/RX_CTL, sheet 1000_BASE_T1_PHY/TX_CTL
(unnamed): sheet NVME_0/PCIE_TX3_N, sheet JETSON/PCIE0_TX3_N
(unnamed): sheet NVME_0/PCIE_TX3_P, sheet JETSON/PCIE0_TX3_P
(unnamed): sheet NVME_0/PCIE_TX2_N, sheet JETSON/PCIE0_TX2_N
(unnamed): sheet NVME_0/PCIE_TX2_P, sheet JETSON/PCIE0_TX2_P
(unnamed): sheet NVME_0/PCIE_TX1_N, sheet JETSON/PCIE0_TX1_N
(unnamed): sheet NVME_0/PCIE_TX1_P, sheet JETSON/PCIE0_TX1_P
(unnamed): sheet NVME_0/PCIE_TX0_N, sheet JETSON/PCIE0_TX0_N
(unnamed): sheet NVME_0/PCIE_TX0_P, sheet JETSON/PCIE0_TX0_P
(unnamed): sheet NVME_0/PCIE_RX3_N, sheet JETSON/PCIE0_RX3_N
(unnamed): sheet NVME_0/PCIE_RX3_P, sheet JETSON/PCIE0_RX3_P
(unnamed): sheet NVME_0/PCIE_RX2_N, sheet JETSON/PCIE0_RX2_N
(unnamed): sheet NVME_0/PCIE_RX2_P, sheet JETSON/PCIE0_RX2_P
(unnamed): sheet NVME_0/PCIE_RX1_N, sheet JETSON/PCIE0_RX1_N
(unnamed): sheet NVME_0/PCIE_RX1_P, sheet JETSON/PCIE0_RX1_P
(unnamed): sheet NVME_0/PCIE_RX0_N, sheet JETSON/PCIE0_RX0_N
(unnamed): sheet NVME_0/PCIE_RX0_P, sheet JETSON/PCIE0_RX0_P
(unnamed): sheet NVME_0/PCIE_CLK_N, sheet JETSON/PCIE0_CLK_N
(unnamed): sheet NVME_0/PCIE_CLK_P, sheet JETSON/PCIE0_CLK_P
(unnamed): sheet NVME_0/3V3_PCIE_nRST, sheet JETSON/3V3_PCIE0_nRST
(unnamed): sheet NVME_0/3V3_PCIE_nWAKE, sheet JETSON/3V3_PCIE0_nWAKE
(unnamed): sheet NVME_1/WIFI_PCIE_TX0_P, sheet JETSON/PCIE1_TX0_P
(unnamed): sheet NVME_1/WIFI_PCIE_TX0_N, sheet JETSON/PCIE1_TX0_N
(unnamed): sheet NVME_1/WIFI_PCIE_RX0_P, sheet JETSON/PCIE1_RX0_P
(unnamed): sheet NVME_1/WIFI_PCIE_RX0_N, sheet JETSON/PCIE1_RX0_N
(unnamed): sheet NVME_1/WIFI_PCIE_CLK_P, sheet JETSON/PCIE1_CLK_P
(unnamed): sheet NVME_1/WIFI_PCIE_CLK_N, sheet JETSON/PCIE1_CLK_N
(unnamed): sheet NVME_1/3V3_WIFI_PCIE_CLKREQ, sheet JETSON/3V3_PCIE1_CLKREQ
(unnamed): sheet NVME_1/3V3_nWIFI_PCIE_RST, sheet JETSON/3V3_PCIE1_nRST

Not connected (* = marked no-connect by the designer): J?#8 14(RSVD)*

## Layout directives
differential pair; differential pair class 100DIFF: P1_CK_N, P1_CK_P, P1_D0_N, P1_D0_P, P1_D1_N, P1_D1_P, P1_D2_N, P1_D2_P
net class PWR: 3V3_DES_0, 3V3_DES_1, 3V3_DES_2, 3V3_HDMI, 3V3_INT, 3V3_M2_NVME, 3V3_M2_WIFI, 3V3_MAIN, 3V3_SER_0, 5V0_HDMI, 5V0_INT, 5V0_JETSON, 5V0_MAIN, 5V0_USB, 12V0_AR_0, 12V0_AR_1, 12V0_JETSON, 12V0_MAIN, 12V0_PoC_0, 12V0_PoC_1, FAKRA_0_GND, FAKRA_1_GND, HSD_0_GND, HSD_1_GND, MATENET_GND

## Notes on the sheet
- 23P AMPSEAL
- CONFIRM RAIL DISCHARGE TIMES
- 12V0 BUCK/BST NOT AEC QUAL
- PoC_0 --> DES 0 | 3A
  PoC_1 --> DES 1 | 3A
  PoC_2 --> SER 0 | 2A
- Above all else, this V_SENSE allows the MCU to confirm that MODULE_ID corresponds to the JETSON_VCC being provided
- POWER DISTRIBUTION
- FAKRA
- 2x 4P INPUT
- ADD PUs FOR THIS I2C
- HSD
- 2x 2P BIDIR+PWR
- HDMI
- FOR DBG ONLY
- H-MTD
- 1P BIDIR
- Labels drawn without touching a wire or pin: 3V3_3V3_MAIN_ENABLE, 3V3_5V0_MAIN_ENABLE, 3V3_12V0_MAIN_ENABLE
- (in symbol CMP-002-00098-1) RF1; RF2; RF3; RF4; DC1; DC2

## Library data of the parts
C?#1-C?#20 = CMP-001-00058-1: LARGE PADS, 0402 CAP, CHANGE COMMENT TO MATCH REAL P/N; Capacitor Type: Ceramic; Min Operating Temperature: -55°C; Mounting Technology: Surface Mount; Pins: 2; Case/Package: 0402; RoHS Compliant: Yes; Max Operating Temperature: 85°C
F?#1-F?#15 = CMP-07399-000013-1: FUSE BOARD MOUNT 2A 63VDC 1206; Voltage Rating (DC): 63V; Fuse Type: Board Mount (Cartridge Style Excluded); Approvals: UL; Mount: Surface Mount; Min Operating Temperature: -20°C; Max Operating Temperature: 105°C; Case Code (Imperial): 1206; Packaging: Cut Tape; Current Rating: 2A; RoHS Compliant: Yes; Series: SinglFuse™ SF-1206FP; Case Code (Metric): 3216; Case/Package: 1206
J?#1-J?#3 = CMP-03369-000157-2: CONN HEADER R/A 23POS 4MM; Max Voltage Rating (AC): 250V; PCB Thickness: 0.062inch; PCB Mount Alignment: Yes (With); Primary Type: Rectangular; Number of Signal Positions: 23; Row Spacing: 0.157inch; Current Rating: 17A; Connector System: Wire-to-Device; Number of Ports: 1; Shielding: Unshielded; PCB Mount Retention: With; Circuit Application: Power; Tab Thickness: 1.3mm; Gender: Male; Contact Shape: Circular; Mount: Through Hole; ELV: Compliant; Orientation: Right Angle; Lead Free: Lead Free; Contact Plating: Tin; Package Quantity: 1; RoHS Compliant: Yes; Connector Type: Header; Series: Ampseal; Termination: Solder; Voltage Rating (AC): 250V; Contact Material: Brass; Number of Rows: 3; Depth: 37.9mm; Housing Material: Polybutylene; Fastening Type: Ramp; Width: 37.9mm; Flammability Rating: UL94 V-0; Housing Color: Black; Radiation Hardening: No; Contact Type: Male Pin; Sealable: Yes (With); Length: 60.8mm; Max Operating Temperature: 221°C; Packaging: Bulk; Number of Positions: 23; Insulation Material: PBT; Pitch: 0.157inch; Contact Finish - Mating: TIN; Color: Black; Number of Terminals/Pins: 23; Insulation Color: Black; Number of Contacts: 23; Min Operating Temperature: -40°C
J?#4 J?#5 = CMP-002-00044-4: Connector RF Mini-FAKRA Plug 9GHz 50Ohm Solder Right Angle Through Hole; Source: fakra4ch.SchLib; Component Type: Standard; Pins: 9; Design Item ID: CMP-002-00085-1
J?#6 J?#7 = CMP-002-00098-1: HSD(M), R/A, 2GHz, 100Ohms, PCB, Solder, Thru-Hole, Tin, Gold, Keyed/Coded, Water Blue; Min Operating Temperature: -40°C; Max Operating Temperature: 105°C
J?#8 = CMP-002-00099-1: HDMI Connector, 19 Contact(s), Female, Straight, Surface Mount Terminal, Locking, Receptacle; Max Operating Temperature: 85°C; Gender: Female; Min Operating Temperature: -20°C; Pins: 19
J?#9 = CMP-002-00103-2: RF Connector, 2 Contact(s), Male, Panel Mount, Board And Panel Mount, Solder Terminal, Plug; Pins: 2; Min Operating Temperature: -40°C; Max Operating Temperature: 105°C
R?#1-R?#24 = CMP-009-00118-2: READ THE NAME; Pins: 2; Component Type: Standard; Design Item ID: CMP-009-00206-2; Source: 0402jump.SchLib